# Altium schematic sheet AUDIO&ETHNET.SchDoc
size A4
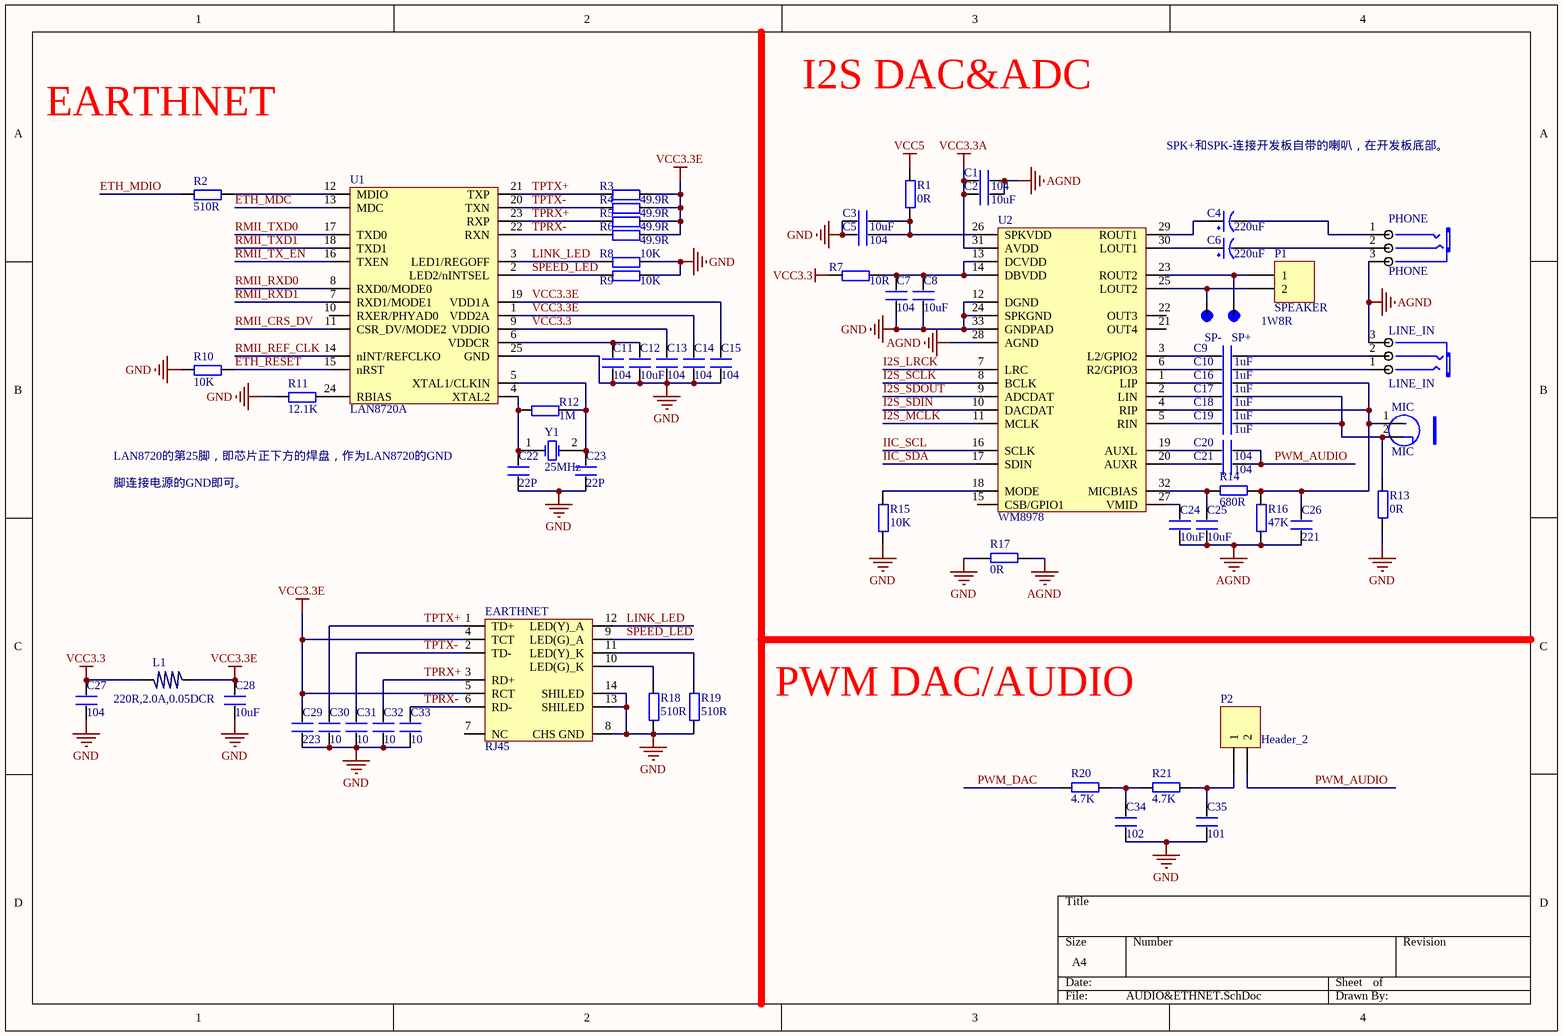
[diagram p0: AUDIO&ETHNET.SchDoc]

## Parts
C1  104  [R0603]
C2  10uF  [1206]
C3  10uF  [1206]
C4  220uF  [CC6.56.5]
C5  104  [R0603]
C6  220uF  [CC6.56.5]
C7  104  [R0603]
C8  10uF  [1206]
C9  1uF  [R0603]
C10  1uF  [R0603]
C11  104  [R0603]
C12  10uF  [1206]
C13  104  [R0603]
C14  104  [R0603]
C15  104  [R0603]
C16  1uF  [R0603]
C17  1uF  [R0603]
C18  1uF  [R0603]
C19  1uF  [R0603]
C20  104  [R0603]
C21  104  [R0603]
C22  22P  [R0603]
C23  22P  [R0603]
C24  10uF  [1206]
C25  10uF  [1206]
C26  221  [R0603]
C27  104  [R0603]
C28  10uF  [1206]
C29  223  [R0603]
C30  10  [R0603]
C31  10  [R0603]
C32  10  [R0603]
C33  10  [R0603]
C34  102  [R0603]
C35  101  [R0603]
EARTHNET  RJ45  [HR911105A]
L1  220R,2.0A,0.05DCR  [R0603]
LINE_IN  LINE_IN  [PHONE_ST]
MIC  MIC  [MIC6027]
P1  SPEAKER  [HDR1X2]
P2  Header_2  [HDR1X2]
PHONE  PHONE  [PHONE_ST]
R1  0R  [R0603]
R2  510R  [R0603]
R3  49.9R  [R0603]
R4  49.9R  [R0603]
R5  49.9R  [R0603]
R6  49.9R  [R0603]
R7  10R  [R0603]
R8  10K  [R0603]
R9  10K  [R0603]
R10  10K  [R0603]
R11  12.1K  [R0603]
R12  1M  [R0603]
R13  0R  [R0603]
R14  680R  [R0603]
R15  10K  [R0603]
R16  47K  [R0603]
R17  0R  [R0603]
R18  510R  [R0603]
R19  510R  [R0603]
R20  4.7K  [R0603]
R21  4.7K  [R0603]
SP+  TEST_POINT  [TEST_POINT]  (value not drawn)
SP-  TEST_POINT  [TEST_POINT]  (value not drawn)
U1  LAN8720A  [QFN24_NEW]
U2  WM8978  [qfn32]
Y1  25MHz  [XTAL_US]

## Nets
AGND: C1.1 C2.1 C24.2 C25.2 C26.2 LINE_IN.3(COM) PHONE.3(COM) R16.1 R17.1 U2.28(AGND)
GND: C3.2 C5.2 C7.2 C8.2 C11.1 C12.1 C13.1 C14.1 C15.1 C22.1 C23.1 C27.1 C28.1 C29.1 C30.1 C31.1 C32.1 C33.1 C34.1 C35.1 EARTHNET.8(CHS_GND) EARTHNET.13(SHILED) EARTHNET.14(SHILED) R8.2 R9.2 R10.1 R11.1 R13.1 R15.1 R17.2 R18.1 R19.1 U1.25(GND) U2.12(DGND) U2.24(SPKGND) U2.33(GNDPAD)
VCC3.3: C13.2 C27.2 L1.2 R7.1 U1.9(VDDIO)
VCC3.3A: C1.2 C2.2 U2.31(AVDD)
VCC3.3E: C14.2 C15.2 C28.2 C29.2 EARTHNET.4(TCT) EARTHNET.5(RCT) L1.1 R3.2 R4.2 R5.2 R6.2 U1.1(VDD2A) U1.19(VDD1A)
VCC5: R1.2
ETH_MDC: U1.13(MDC)
ETH_MDIO: R2.1
ETH_RESET: R10.2 U1.15(nRST)
I2S_LRCK: U2.7(LRC)
I2S_MCLK: U2.11(MCLK)
I2S_SCLK: U2.8(BCLK)
I2S_SDIN: U2.10(DACDAT)
I2S_SDOUT: U2.9(ADCDAT)
IIC_SCL: U2.16(SCLK)
IIC_SDA: U2.17(SDIN)
LINK_LED: EARTHNET.12(LED(Y)_A) R8.1 U1.3(LED1/REGOFF)
PWM_AUDIO: C20.2 C21.2 P2.2
PWM_DAC: R20.2
RMII_CRS_DV: U1.11(CSR_DV/MODE2)
RMII_REF_CLK: U1.14(nINT/REFCLKO)
RMII_RXD0: U1.8(RXD0/MODE0)
RMII_RXD1: U1.7(RXD1/MODE1)
RMII_TX_EN: U1.16(TXEN)
RMII_TXD0: U1.17(TXD0)
RMII_TXD1: U1.18(TXD1)
SPEED_LED: EARTHNET.9(LED(G)_A) R9.1 U1.2(LED2/nINTSEL)
TPRX+: C32.2 EARTHNET.3(RD+) R5.1 U1.23(RXP)
TPRX-: C33.2 EARTHNET.6(RD-) R6.1 U1.22(RXN)
TPTX+: C30.2 EARTHNET.1(TD+) R3.1 U1.21(TXP)
TPTX-: C31.2 EARTHNET.2(TD-) R4.1 U1.20(TXN)
NetC3_1: C3.1 C5.1 R1.1 U2.26(SPKVDD)
NetC4_1: C4.1(VCC) U2.29(ROUT1)
NetC4_2: C4.2(GND) PHONE.1(CHL)
NetC6_1: C6.1(VCC) U2.30(LOUT1)
NetC6_2: C6.2(GND) PHONE.2(CHR)
NetC7_1: C7.1 C8.1 R7.2 U2.13(DCVDD) U2.14(DBVDD)
NetC9_1: C9.1 U2.3(L2/GPIO2)
NetC9_2: C9.2 LINE_IN.2(CHR)
NetC10_1: C10.1 U2.6(R2/GPIO3)
NetC10_2: C10.2 LINE_IN.1(CHL)
NetC11_2: C11.2 C12.2 U1.6(VDDCR)
NetC16_1: C16.1 U2.1(LIP)
NetC16_2: C16.2 C18.2 C26.1 MIC.1(VCC) R14.1 R16.2
NetC17_1: C17.1 U2.2(LIN)
NetC17_2: C17.2 C19.2 MIC.2(GND) R13.2
NetC18_1: C18.1 U2.4(RIP)
NetC19_1: C19.1 U2.5(RIN)
NetC20_1: C20.1 U2.19(AUXL)
NetC21_1: C21.1 U2.20(AUXR)
NetC22_2: C22.2 R12.1 U1.4(XTAL2) Y1.1(OSC1)
NetC23_2: C23.2 R12.2 U1.5(XTAL1/CLKIN) Y1.2(OSC2)
NetC24_1: C24.1 U2.27(VMID)
NetC25_1: C25.1 R14.2 U2.32(MICBIAS)
NetC34_2: C34.2 R20.1 R21.2
NetC35_2: C35.2 P2.1 R21.1
NetEARTHNET_10: EARTHNET.10(LED(G)_K) R18.2
NetEARTHNET_11: EARTHNET.11(LED(Y)_K) R19.2
NetP1_1: P1.1 SP+.1 U2.23(ROUT2)
NetP1_2: P1.2 SP-.1 U2.25(LOUT2)
NetR2_2: R2.2 U1.12(MDIO)
NetR11_2: R11.2 U1.24(RBIAS)
NetR15_2: R15.2 U2.18(MODE)

Not connected (* = marked no-connect by the designer): EARTHNET 7(NC); U1 10(RXER/PHYAD0); U2 15(CSB/GPIO1) 21(OUT4) 22(OUT3)

## Notes on the sheet
- I2S DAC&ADC
- EARTHNET
- SPK+和SPK-连接开发板自带的喇叭，在开发板底部。
- 1W8R
- LAN8720的第25脚，即芯片正下方的焊盘，作为LAN8720的GND
- 脚连接电源的GND即可。
- PWM DAC/AUDIO

## Library data of the parts
C1-C3 C5 C7-C35 = C
C4 C6 = CAP
EARTHNET = HR911105
L1 = L
LINE_IN PHONE = PHONE_M
P1 P2 = Header 2: Header, 2-Pin; LatestRevisionDate: 17-Jul-2002; LatestRevisionNote: Re-released for DXP Platform.; Publisher: Altium Limited
R1-R21 = R
U1 = LAN8720: ETH PHY
U2 = WM8978: 24bit ADC&DAC
Y1 = XTAL: Crystal Oscillator; Published: 8-Jun-2000; LatestRevisionDate: 17-Jul-2002; LatestRevisionNote: Re-released for DXP Platform.; Publisher: Altium Limited